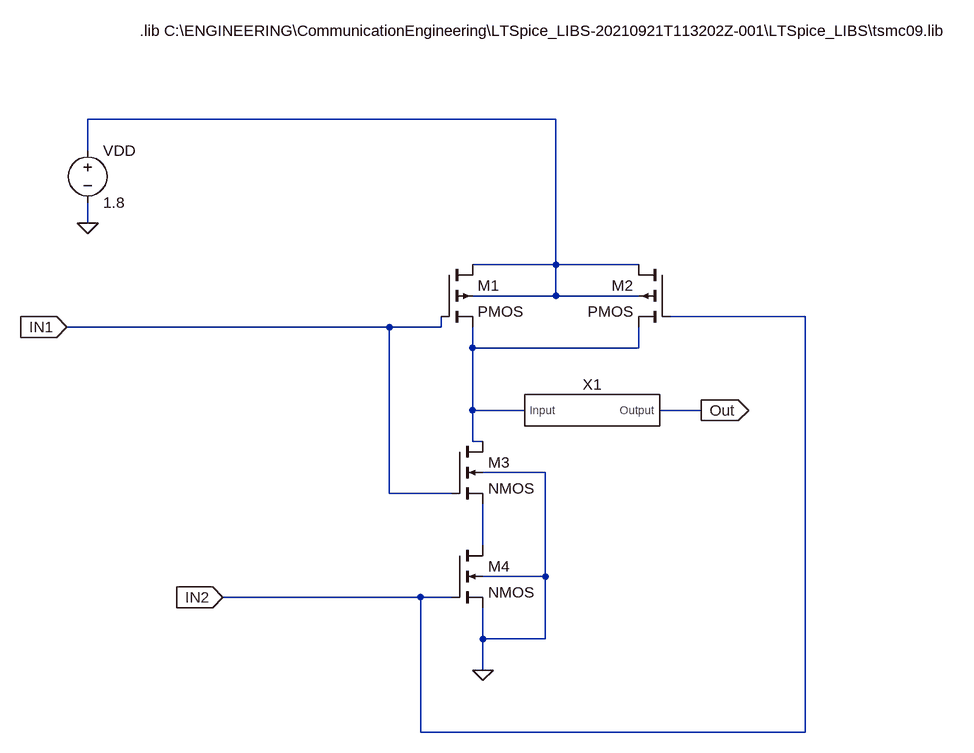
[diagram p0: schematic AND_model1.asc]
AND_model1.asc, the LTspice schematic file:
Version 4
SHEET 1 1644 1012
WIRE 912 64 192 64
WIRE 192 112 192 64
WIRE 192 224 192 192
WIRE 912 288 912 64
WIRE 912 288 784 288
WIRE 1040 288 912 288
WIRE 912 336 912 288
WIRE 912 336 784 336
WIRE 1040 336 912 336
WIRE 1296 368 1088 368
WIRE 656 384 160 384
WIRE 736 384 736 368
WIRE 736 384 656 384
WIRE 784 416 784 384
WIRE 1040 416 1040 384
WIRE 1040 416 784 416
WIRE 784 512 784 416
WIRE 864 512 784 512
WIRE 1136 512 1072 512
WIRE 784 560 784 512
WIRE 800 560 784 560
WIRE 896 608 800 608
WIRE 656 640 656 384
WIRE 752 640 656 640
WIRE 800 720 800 656
WIRE 896 768 896 608
WIRE 896 768 800 768
WIRE 704 800 400 800
WIRE 752 800 704 800
WIRE 800 864 800 816
WIRE 896 864 896 768
WIRE 896 864 800 864
WIRE 800 912 800 864
WIRE 704 1008 704 800
WIRE 1296 1008 1296 368
WIRE 1296 1008 704 1008
FLAG 192 224 0
FLAG 800 912 0
FLAG 1136 512 Out
IOPIN 1136 512 Out
FLAG 160 384 IN1
IOPIN 160 384 In
FLAG 400 800 IN2
IOPIN 400 800 In
SYMBOL pmos4 736 288 R0
SYMATTR InstName M1
SYMATTR Value2 l=90n w=440n
SYMBOL pmos4 1088 288 M0
SYMATTR InstName M2
SYMATTR Value2 l=90n w=440n
SYMBOL nmos4 752 560 R0
SYMATTR InstName M3
SYMATTR Value2 l=90n w=220n
SYMBOL nmos4 752 720 R0
SYMATTR InstName M4
SYMATTR Value2 l=90n w=220n
SYMBOL voltage 192 96 R0
SYMATTR InstName VDD
SYMATTR Value 1.8
SYMBOL NOT_model1 960 512 R0
SYMATTR InstName X1
TEXT 272 -72 Left 2 !.lib C:\\ENGINEERING\\CommunicationEngineering\\LTSpice_LIBS-20210921T113202Z-001\\LTSpice_LIBS\\tsmc09.lib

The netlist it stands for:
* AND_model1.asc
M1 N001 IN1 N002 N001 PMOS l=90n w=440n
M2 N001 IN2 N002 N001 PMOS l=90n w=440n
M3 N002 IN1 N003 0 NMOS l=90n w=220n
M4 N003 IN2 0 0 NMOS l=90n w=220n
VDD N001 0 1.8
XX1 N002 Out NOT0  ; pins Input Output
.model NMOS NMOS
.model PMOS PMOS
.lib standard.mos
.lib C:\ENGINEERING\CommunicationEngineering\LTSpice_LIBS-20210921T113202Z-001\LTSpice_LIBS\tsmc09.lib
.backanno
.end